# Altium schematic sheet SAMD21_Main_SCH.SchDoc: TITLE:
size A4; Date: Date:; >LAST_DATE_TIME: 15.01.2016 23:45:31; Sheet:: Sheet:; >SHEET: 1; REV:: REV:; >DRAWING_NAME: sparkfun-samd21-mini-breakout.sch; Released under the Creative Commons: Released under the Creative Commons; Attribution Share-Alike 4.0 License: Attribution Share-Alike 4.0 License; https://creativecommons.org/licenses/by-sa/4.0/: https://creativecommons.org/licenses/by-sa/4.0/; Design by:: Design by:
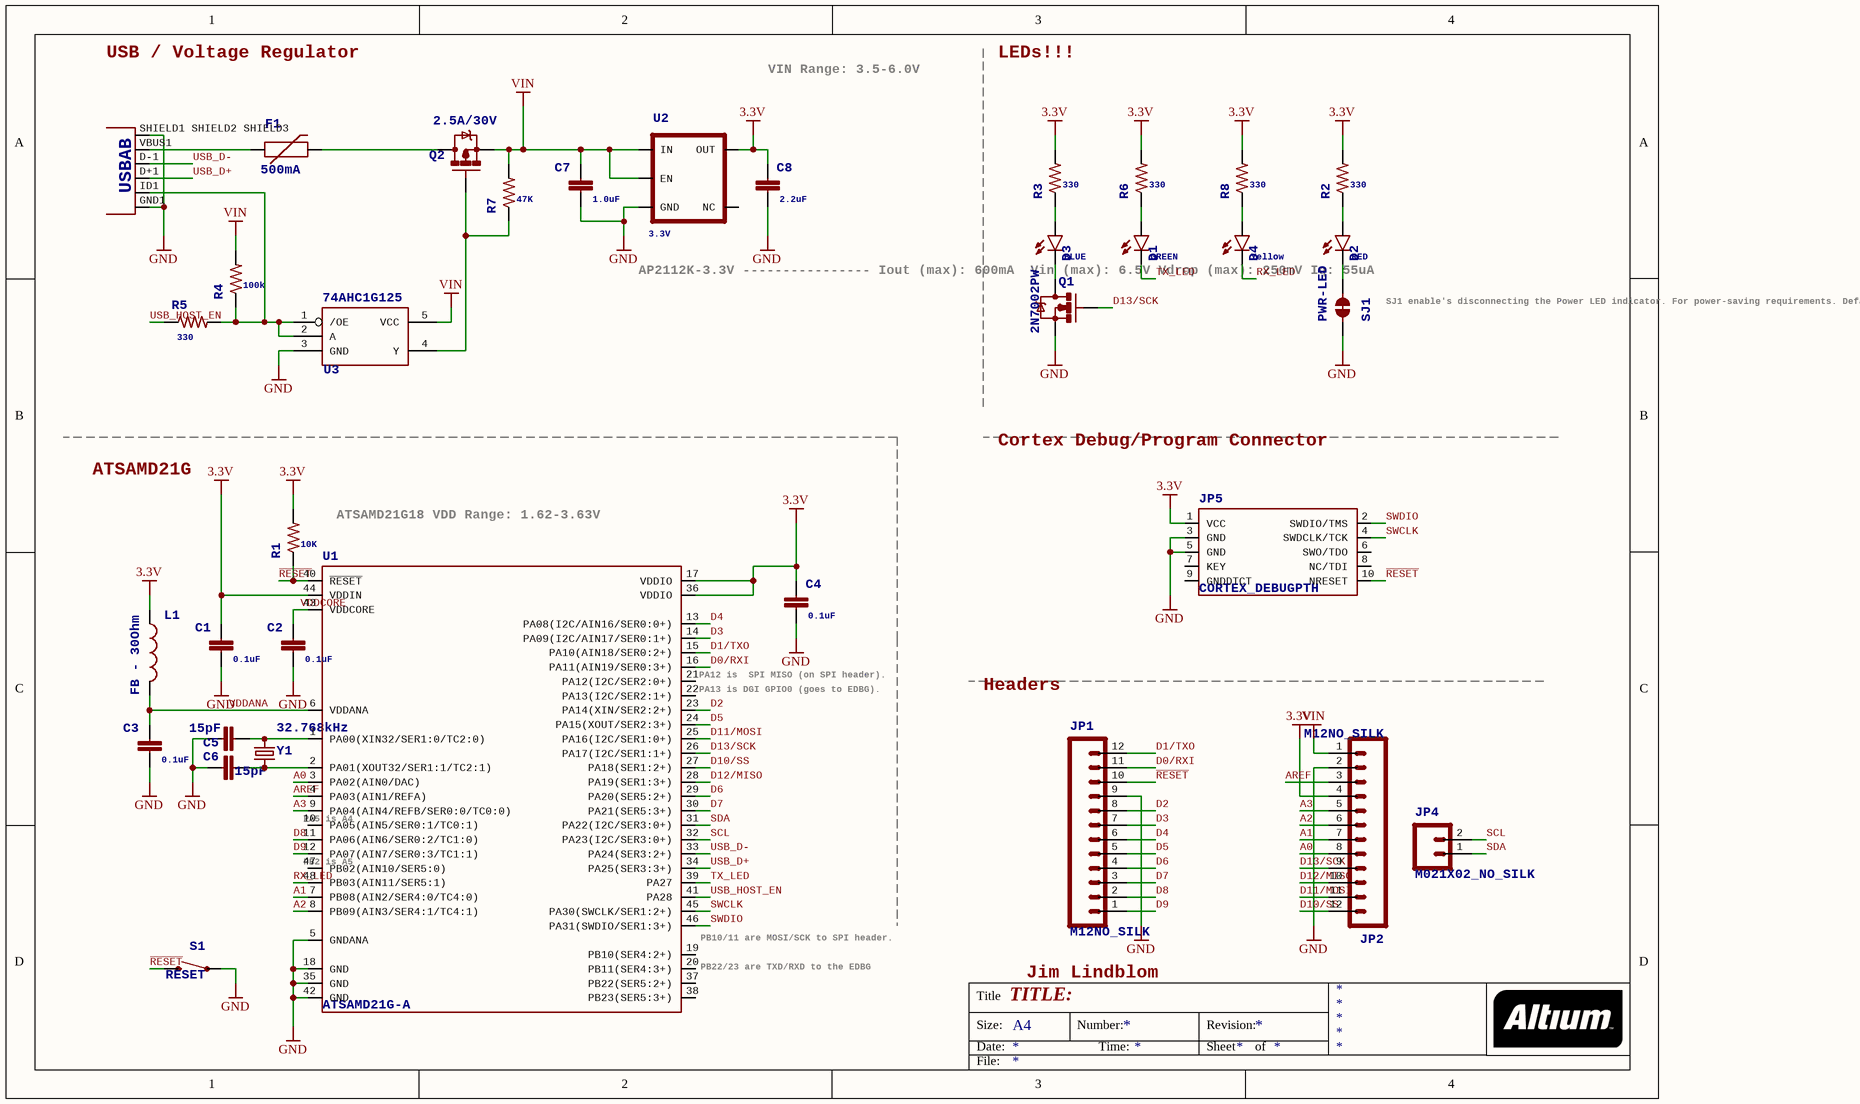
[diagram p0: SAMD21_Main_SCH.SchDoc]

## Parts
C1  >NAME: C1  [0402-CAP]  (hidden comment: 0.1uF)
C2  >NAME: C2  [0402-CAP]  (hidden comment: 0.1uF)
C3  >NAME: C3  [0402-CAP]  (hidden comment: 0.1uF)
C4  >NAME: C4  [0402-CAP]  (hidden comment: 0.1uF)
C5  15pF  [0402-CAP]
C6  15pF  [0402-CAP]
C7  >NAME: C7  [0805-CAP]  (hidden comment: 1.0uF)
C8  >NAME: C8  [0603-CAP]  (hidden comment: 2.2uF)
D1  >NAME: D1  [LED-0603]  (hidden comment: GREEN)
D2  >NAME: D2  [LED-0603]  (hidden comment: RED)
D3  >NAME: D3  [LED-0603]  (hidden comment: BLUE)
D4  >NAME: D4  [LED-0603]  (hidden comment: Yellow)
F1  >NAME: F1  [PTC-1206]  (hidden comment: 500mA)
JP1  >NAME: JP1  [1X12_NO_SILK]  (hidden comment: M12NO_SILK)
JP2  >NAME: JP2  [1X12_NO_SILK]  (hidden comment: M12NO_SILK)
JP3  USB-ABCONN-11794  [USB-AB-MICRO-SMD_V03]  (value not drawn)
JP4  >NAME: JP4  [1X02_NO_SILK]  (hidden comment: M021X02_NO_SILK)
JP5  >Name: JP5  [2X5-PTH-1.27MM]  (hidden comment: CORTEX_DEBUGPTH)
L1  FB - 30Ohm  [0603]
Q1  2N7002PW  [SOT323]
Q2  2.5A/30V  [SOT23-3]
R1  >NAME: R1  [0603-RES]  (hidden comment: 10K)
R2  >NAME: R2  [0603-RES]  (hidden comment: 330)
R3  >NAME: R3  [0603-RES]  (hidden comment: 330)
R4  >NAME: R4  [0603-RES]  (hidden comment: 100k)
R5  >NAME: R5  [0603-RES]  (hidden comment: 330)
R6  >NAME: R6  [0603-RES]  (hidden comment: 330)
R7  >NAME: R7  [0603-RES]  (hidden comment: 47K)
R8  >NAME: R8  [0603-RES]  (hidden comment: 330)
S1  >NAME: S1  [TACTILE_SWITCH_SMD_4.6X2.8MM]  (hidden comment: RESET)
SJ1  >NAME: SJ1  [PAD-JUMPER-2-NC_BY_TRACE_NO_SILK]  (hidden comment: PWR-LED)
U1  >Name: U1  [TQFP-48]  (hidden comment: ATSAMD21G-A)
U2  >NAME: U2  [SOT23-5]  (hidden comment: 3.3V)
U3  >Name: U3  [SOT23-5]  (hidden comment: 74AHC1G125)
Y1  32.768kHz  [CRYSTAL-SMD-3.2X1.5MM]

## Nets
3.3V: C1.1 C4.1 C8.1 JP2.4 JP5.1(VCC) L1.1 R1.2 R2.2 R3.2 R6.2 R8.2 U1.17(VDDIO) U1.36(VDDIO) U1.44(VDDIN) U2.5(OUT)
GND: C1.2 C2.2 C3.2 C4.2 C5.1 C6.2 C7.2 C8.2 JP1.9 JP2.2 JP3.GND1(GND) JP3.SHIELD1_SHIELD2_SHIELD3(SHIELD) JP5.3(GND) JP5.5(GND) Q1.2(S) S1.1_2 SJ1.1 U1.5(GNDANA) U1.18(GND) U1.35(GND) U1.42(GND) U2.2(GND) U3.3(GND)
VIN: C7.1 JP2.1 Q2.2(S) R4.2 R7.2 U2.1(IN) U2.3(EN) U3.5(VCC)
A0: JP2.8 U1.3(PA02(AIN0/DAC))
A1: JP2.7 U1.7(PB08(AIN2/SER4:0/TC4:0))
A2: JP2.6 U1.8(PB09(AIN3/SER4:1/TC4:1))
A3: JP2.5 U1.9(PA04(AIN4/REFB/SER0:0/TC0:0))
AREF: JP2.3 U1.4(PA03(AIN1/REFA))
D0/RXI: JP1.11 U1.16(PA11(AIN19/SER0:3+))
D1/TXO: JP1.12 U1.15(PA10(AIN18/SER0:2+))
D2: JP1.8 U1.23(PA14(XIN/SER2:2+))
D3: JP1.7 U1.14(PA09(I2C/AIN17/SER0:1+))
D4: JP1.6 U1.13(PA08(I2C/AIN16/SER0:0+))
D5: JP1.5 U1.24(PA15(XOUT/SER2:3+))
D6: JP1.4 U1.29(PA20(SER5:2+))
D7: JP1.3 U1.30(PA21(SER5:3+))
D8: JP1.2 U1.11(PA06(AIN6/SER0:2/TC1:0))
D9: JP1.1 U1.12(PA07(AIN7/SER0:3/TC1:1))
D10/SS: JP2.12 U1.27(PA18(SER1:2+))
D11/MOSI: JP2.11 U1.25(PA16(I2C/SER1:0+))
D12/MISO: JP2.10 U1.28(PA19(SER1:3+))
D13/SCK: JP2.9 Q1.1(G) U1.26(PA17(I2C/SER1:1+))
~{RESET}: JP1.10 JP5.10(NRESET) R1.1 S1.3_4 U1.40(~{RESET})
RX_LED: D4.C U1.48(PB03(AIN11/SER5:1))
SCL: JP4.2 U1.32(PA23(I2C/SER3:0+))
SDA: JP4.1 U1.31(PA22(I2C/SER3:0+))
SWCLK: JP5.4(SWDCLK/TCK) U1.45(PA30(SWCLK/SER1:2+))
SWDIO: JP5.2(SWDIO/TMS) U1.46(PA31(SWDIO/SER1:3+))
TX_LED: D1.C U1.39(PA27)
USB_D+: JP3.D+1(D+) U1.34(PA25(SER3:3+))
USB_D-: JP3.D-1(D-) U1.33(PA24(SER3:2+))
USB_HOST_EN: R5.1 U1.41(PA28)
VDDANA: C3.1 L1.2 U1.6(VDDANA)
VDDCORE: C2.1 U1.43(VDDCORE)
NetC5_2: C5.2 U1.1(PA00(XIN32/SER1:0/TC2:0)) Y1.P$2
NetC6_1: C6.1 U1.2(PA01(XOUT32/SER1:1/TC2:1)) Y1.P$1
NetD1_A: D1.A R6.1
NetD2_A: D2.A R2.1
NetD2_C: D2.C SJ1.2
NetD3_A: D3.A R3.1
NetD3_C: D3.C Q1.3(D)
NetD4_A: D4.A R8.1
NetF1_1: F1.1 JP3.VBUS1(VBUS)
NetF1_2: F1.2 Q2.3(D)
NetJP3_ID1: JP3.ID1(USBID) R4.1 R5.2 U3.1(/OE) U3.2(A)
NetQ2_1: Q2.1(G) R7.1 U3.4(Y)

Not connected (* = marked no-connect by the designer): JP5 6(SWO/TDO) 7(KEY) 8(NC/TDI) 9(GNDDTCT); U1 10(PA05(AIN5/SER0:1/TC0:1)) 19(PB10(SER4:2+)) 20(PB11(SER4:3+)) 21(PA12(I2C/SER2:0+)) 22(PA13(I2C/SER2:1+)) 37(PB22(SER5:2+)) 38(PB23(SER5:3+)) 47(PB02(AIN10/SER5:0)); U2 4(NC)

## Notes on the sheet
- USB / Voltage Regulator
- VIN Range: 3.5-6.0V
- LEDs!!!
- AP2112K-3.3V
  ----------------
  Iout (max): 600mA
  Vin (max): 6.5V
  Vdrop (max): 250mV
  Iq: 55uA
- SJ1 enable's disconnecting
  the Power LED indicator. For
  power-saving requirements.
  Default: closed.
- ATSAMD21G
- Cortex Debug/Program Connector
- ATSAMD21G18
  VDD Range: 1.62-3.63V
- (near U1) PA12 is  SPI MISO (on SPI header).
- (near U1) PA13 is DGI GPIO0 (goes to EDBG).
- Headers
- (near U1) PA5 is A4
- (near U1) PB2 is A5
- (near U1) PB22/23 are TXD/RXD to the EDBG
- (near U1) PB10/11 are MOSI/SCK to SPI header.
- (near JP1) Jim Lindblom
- Title
- Size:
- Date:
- A4
- Number:
- Time:
- Revision:
- Sheet
- of
- File:

## Library data of the parts
C1-C4 = 0.1UF-16V(+-10%)(0402): PROD_ID: CAP-12416; VALUE: 0.1uF
C5 C6 = 15PF-50V(+-5%)(0402)
C7 = 1.0UF-25V-+80/-20(0805)": CAP-11625; PROD_ID: CAP-11625; VALUE: 1.0uF
C8 = 2.2UF-10V-20%(0603): CAP-07888; PROD_ID: CAP-07888; VALUE: 2.2uF
D1 = LED-GREEN0603: <B>Various green LEDs<br><br></B> / Green LEDs used in SFE Production<br><br> / 0603- DIO-00821<br> / LARGE- DIO-00862<br> / LILYPAD- DIO-09910<br>; PROD_ID: DIO-00821; VALUE: GREEN
D2 = LED-RED0603: Assorted Red LEDs<br> / LilyPad 1206- DIO-09912<br> / 1206- DIO-00809<br> / 0603- DIO-00819<br> / "SMART" means more efficient and expensive; PROD_ID: DIO-00819; VALUE: RED
D3 = LED-BLUE0603: <H3>Blue LEDs for production use</H3><p> / Various blue LEDs stocked by SparkFun production<br> / 0603 - DIO-08575<br> / Rebel - DIO-09553<br> / 1206 - DIO-09911; PROD_ID: DIO-08575; VALUE: BLUE
D4 = LED-YELLOW0603: Yellow SMD LEDs<br> / LilyPad 1206- DIO-09909<br> / 0603- DIO-09003<br> / "SMART" means more efficient and expensive; PROD_ID: DIO-09003; VALUE: Yellow
F1 = PTCSMD: <b>Resettable Fuse PTC</b> / Resettable Fuse. Spark Fun Electronics SKU : COM-08357; PROD_ID: RES-11150; >VALUE: 500mA
JP1 JP2 = M12NO_SILK: <b>Header 12</b> / Standard 12-pin 0.1" header. Use with straight break away headers (SKU : PRT-00116), right angle break away headers (PRT-00553), swiss pins (PRT-00743), machine pins (PRT-00117), and female headers (PRT-00115).; >VALUE: M12NO_SILK
JP3 = USB-ABCONN-11794: This is a USB AB connector that is compatible with USB OTG. i.e. this connector can serve as a host or device; PROD_ID: CONN-11794; USBAB: USBAB
JP4 = M021X02_NO_SILK: Standard 2-pin 0.1" header. Use with <br> / - straight break away headers ( PRT-00116)<br> / - right angle break away headers (PRT-00553)<br> / - swiss pins (PRT-00743)<br> / - machine pins (PRT-00117)<br> / - female headers (PRT-00115)<br><br> / Molex polarized connector foot print use with: PRT-08233 with associated crimp pins and housings.<br><br> / 2.54_SCREWTERM for use with  PRT-10571.<br><br> / 3.5mm Screw Terminal footprints for  PRT-08084<br><br> / 5mm Screw Terminal footprints for use with PRT-08432; >VALUE: M021X02_NO_SILK
JP5 = CORTEX_DEBUGPTH: <h3>Cortex Debug Connector</h3> / <p><a href="http://infocenter.arm.com/help/topic/com.arm.doc.faqs/attached/13634/cortex_debug_connectors.pdf">Datasheet</a></p>; >Value: CORTEX_DEBUGPTH
L1 = INDUCTOR0603: <b>Inductors</b><p> / Basic Inductor/Choke - 0603 and 1206. Footprints are not proven and vary greatly between part numbers.<br> / INDUCTOR POWER 3.3UH 4.0A SMD<br> / 0.197" L x 0.197" W x 0.177" H (5.00mm x 5.00mm x 4.50mm)
Q1 = MOSFET-NCHANNEL2N7002PW: <B>Common NMOSFET Parts</b><p> / <table border = "1"> / <tr><th>MFG P/N</th><th>Store ID</th><th>Prod ID</th></tr> / <tr><td>FDD8780</td><td></td><td>TRANS-09984</td></tr> / <tr><td>SI7820DN</td><td></td><td>TRANS-11055</td></tr> / <tr><td>FDS6630A</td><td></td><td>IC-08089</td></tr> / <tr><td>2N7002PW</td><td></td><td>TRANS-11151</td></tr> / <tr><td>FQP30N06L</td>  <td>COM-10213</td><td>TRANS-10060</td></tr> / <tr><td>BSS123LT1G</td><td></td><td>TRANS-08345</td></tr> / <tr><td>BSS138</td><td></td><td>TRANS-00830</td></tr> / <tr><td>BS170</td><td></td><td></td></tr> / <tr><td>2N7000</td><td></td><td></td></tr> / </table>
Q2 = MOSFET-PCHANNELDMG2307L: Generic PMOSFET / <ul> / <li> / IRLML2244 - TRANS-11153 / (SOT-23 -20V -4.3A) / (1.Gate 2.Source 3.Drain) / </li> / <li> / FQP27P06 - / <a href="http://www.sparkfun.com/products/10349">COM-10349</a> / (TO-220 -60V -27A) / (1.Gate 2.Source 3.Drain) / </li> / </ul>
R1 = 10KOHM-1/10W-1%(0603)0603: RES-00824; PROD_ID: RES-00824; VALUE: 10K
R2 R3 R5 R6 R8 = 330OHM1/10W1%(0603): RES-00818; PROD_ID: RES-00818; VALUE: 330
R4 = 100KOHM-1/10W-1%(0603): RES-07828; PROD_ID: RES-07828; VALUE: 100k
R7 = 47KOHM1/10W1%(0603): RES-07871; PROD_ID: RES-07871; VALUE: 47K
S1 = SWITCH-MOMENTARY-2SMD-4.6X2.8MM: Various NO switches- pushbuttons, reed, etc; PROD_ID: SWCH-13065; >VALUE: RESET
SJ1 = JUMPER-PAD-2-NC_BY_TRACENO_SILK: >VALUE: PWR-LED
U1 = ATSAMD21G-A: <h3>Atmel SAMD21G SMART ARM-Based Microcontroller</h3> / <p>The Atmel ® | SMART ™ SAM D21 is a series of low-power microcontrollers using the 32-bit / ARM ® Cortex ® -M0+ processor, and ranging from 32- to 64-pins with up to 256KB Flash and / 32KB of SRAM. The SAM D21 devices operate at a maximum frequency of 48MHz and reach / 2.46 CoreMark/MHz. They are designed for simple and intuitive migration with identical / peripheral modules, hex compatible code, identical linear address map and pin compatible / migration paths between all devices in the product series. All devices include intelligent and / flexible peripherals, Atmel Event System for inter-peripheral signaling, and support for capacitive / touch button, slider and wheel user interfaces.</p>; PROD_ID: IC-13064; >Value: ATSAMD21G-A
U2 = V_REG_AP2112K-3.3V: <h3>AP2112 - 600mA CMOS LDO Regulator w/ Enable</h3> / <p>The AP2112 is CMOS process low dropout linear regulator with enable function, the regulator delivers a guaranteed 600mA (min.) continuous load current.</p> / <p>Features<br> / <ul> / <li>Output Voltage Accuracy: ±1.5% </li> / <li>Output Current: 600mA (Min.) </li> / <li>Foldback Short Current Protection: 50mA </li> / <li>Enable Function to Turn ON/OFF VOUT</li> / <li>Low Dropout Voltage (3.3V): 250mV (Typ.) @IOUT=600mA </li> / <li>Excellent Load Regulation: 0.2%/A (Typ.) </li> / <li>Excellent Line Regulation: 0.02%/V (Typ.) </li> / <li>Low Quiescent Current: 55μA (Typ.)</li> / <li>Low Standby Current: 0.01μA (Typ.)</li> / <li>Low Output Noise: 50μVRMS </li> / <li>PSRR: 100Hz -65dB, 1kHz -65dB </li> / <li> OTSD Protection </li> / <li>Stable  with  1.0μF Flexible Cap: Ceramic, Tantalum and Aluminum Electrolytic </li> / <li>Operation Temperature Range: -40°C to 85°C </li> / <li>ESD: MM 400V, HBM 4000V</li> / </ul> / </p>; PROD_ID: VREG-12457; VALUE: 3.3V
U3 = 74AHC1G125: Single bus buffer gate with 3-state output; PROD_ID: IC-11920; >Value: 74AHC1G125
Y1 = CRYSTAL3.2X1.5MM: Various standard crystals. Proven footprints.